# EAGLE schematic HW_RPI_10in_Rack (EAGLE 9.2.1)

## Sheet 1 of 4: CM5 MODULE
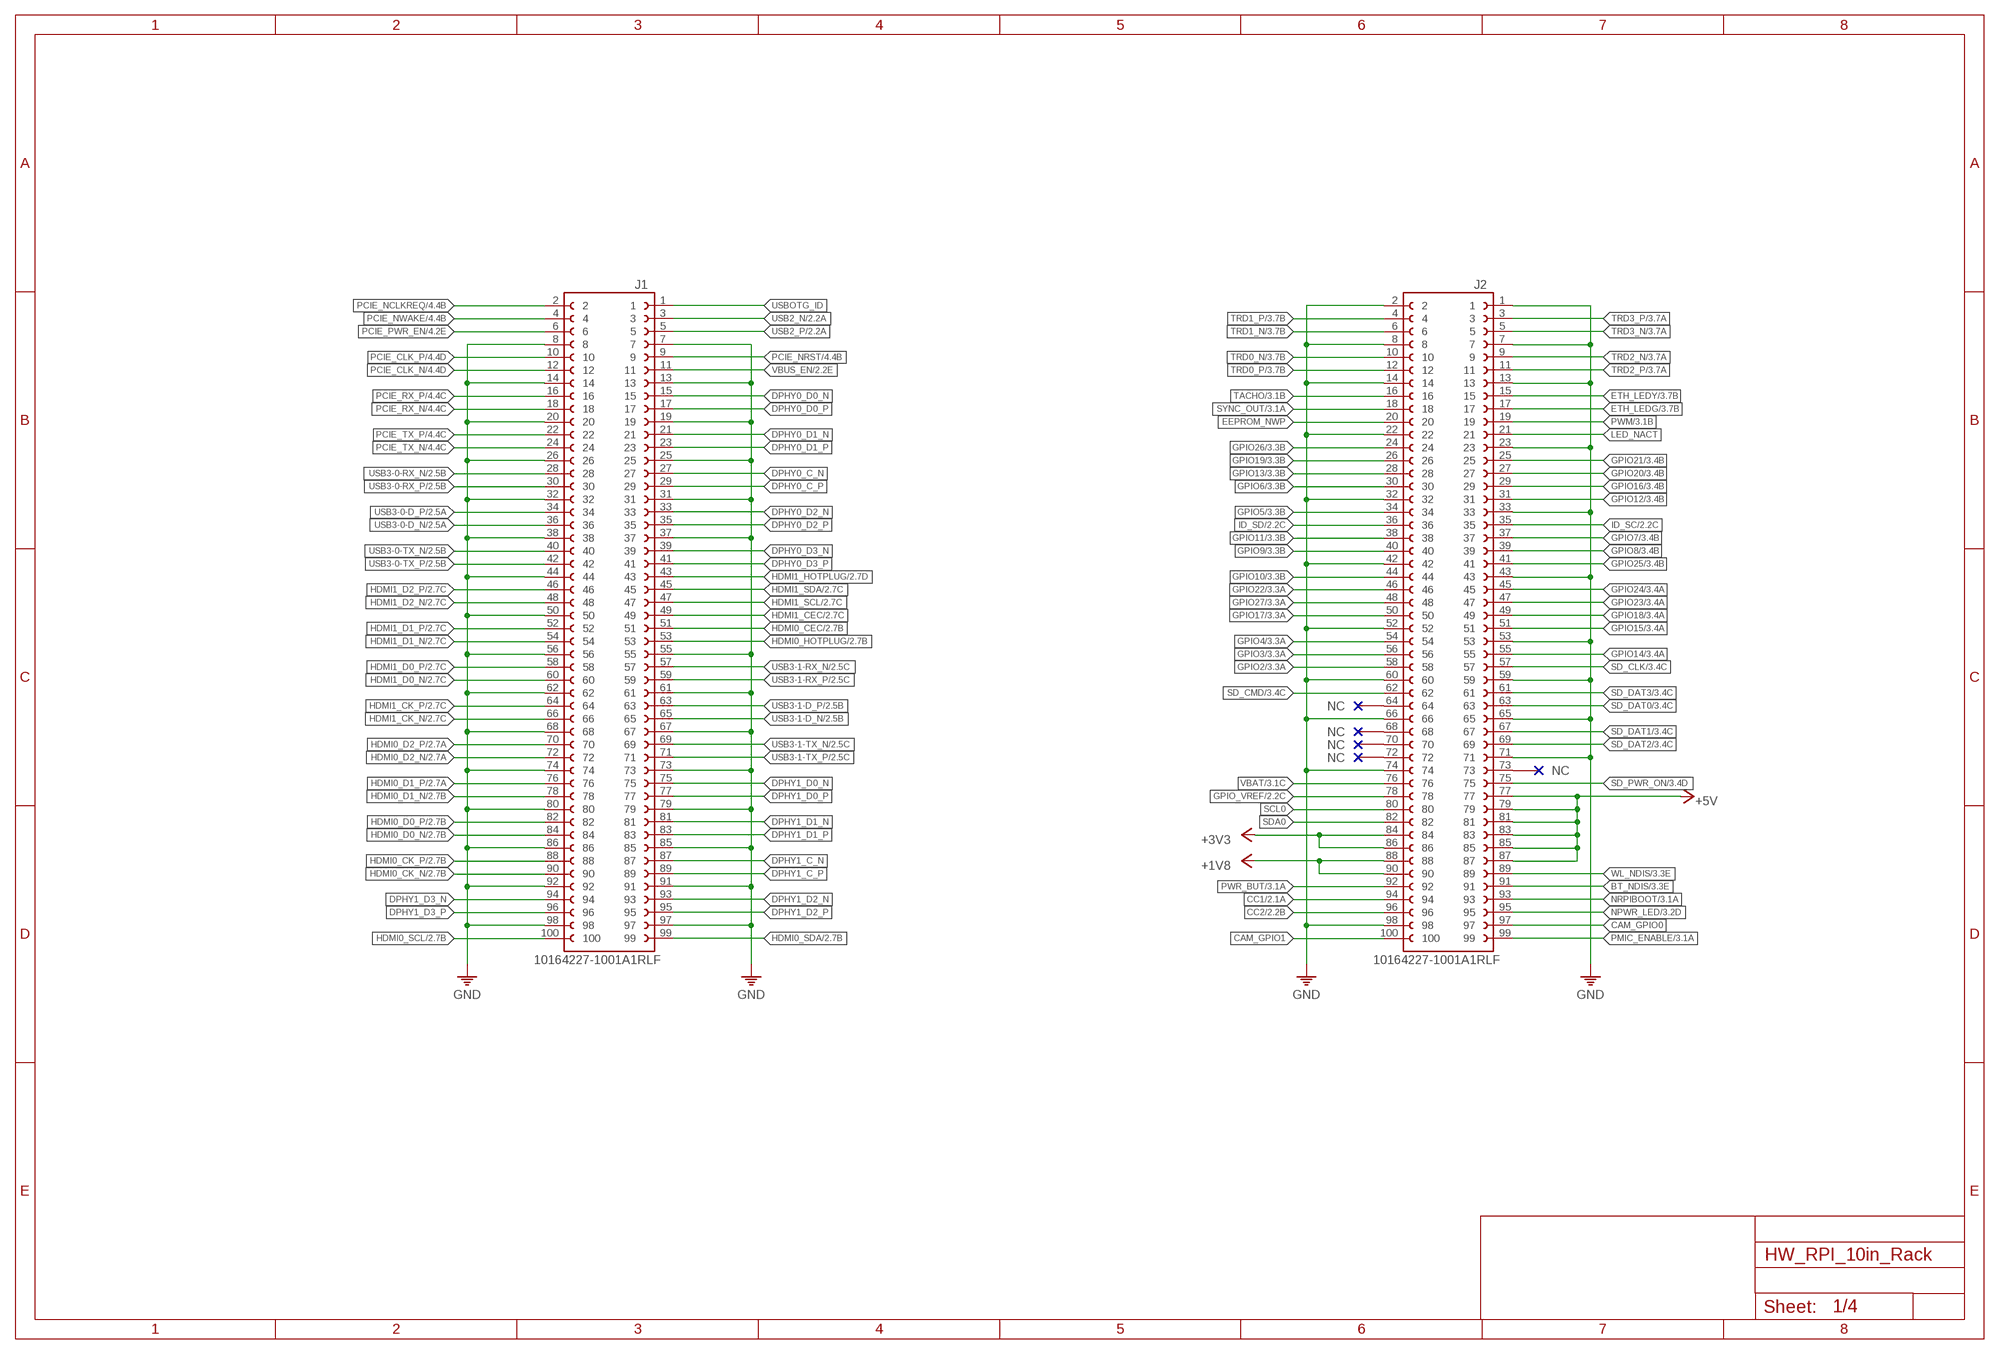
[diagram p0: schematic, sheet 1]

### Parts
J1  10164227-1001A1RLF  [AMPHENOL_10164227-1001A1RLF]
J2  10164227-1001A1RLF  [AMPHENOL_10164227-1001A1RLF]

### Nets
+1V8: J2.88 J2.90 ; also sheet 3
+3V3: J2.84 J2.86 ; also sheet 3,4
+5V: J2.77 J2.79 J2.81 J2.83 J2.85 J2.87 ; also sheet 2,3,4
BT_NDIS: J2.91 ; also sheet 3
CAM_GPIO0: J2.97
CAM_GPIO1: J2.100
CC1: J2.94 ; also sheet 2
CC2: J2.96 ; also sheet 2
DPHY0_C_N: J1.27
DPHY0_C_P: J1.29
DPHY0_D0_N: J1.15
DPHY0_D0_P: J1.17
DPHY0_D1_N: J1.21
DPHY0_D1_P: J1.23
DPHY0_D2_N: J1.33
DPHY0_D2_P: J1.35
DPHY0_D3_N: J1.39
DPHY0_D3_P: J1.41
DPHY1_C_N: J1.87
DPHY1_C_P: J1.89
DPHY1_D0_N: J1.75
DPHY1_D0_P: J1.77
DPHY1_D1_N: J1.81
DPHY1_D1_P: J1.83
DPHY1_D2_N: J1.93
DPHY1_D2_P: J1.95
DPHY1_D3_N: J1.94
DPHY1_D3_P: J1.96
EEPROM_NWP: J2.20
ETH_LEDG: J2.17 ; also sheet 3
ETH_LEDY: J2.15 ; also sheet 3
GND: J1.7 J1.8 J1.13 J1.14 J1.19 J1.20 J1.25 J1.26 J1.31 J1.32 J1.37 J1.38 J1.44 J1.50 J1.55 J1.56 J1.61 J1.62 J1.67 J1.68 J1.73 J1.74 J1.79 J1.80 J1.85 J1.86 J1.91 J1.92 J1.97 J1.98 J2.1 J2.2 J2.7 J2.8 J2.13 J2.14 J2.22 J2.23 J2.32 J2.33 J2.42 J2.43 J2.52 J2.53 J2.59 J2.60 J2.65 J2.66 J2.71 J2.74 J2.98 ; also sheet 2,3,4
GPIO2: J2.58 ; also sheet 3
GPIO3: J2.56 ; also sheet 3
GPIO4: J2.54 ; also sheet 3
GPIO5: J2.34 ; also sheet 3
GPIO6: J2.30 ; also sheet 3
GPIO7: J2.37 ; also sheet 3
GPIO8: J2.39 ; also sheet 3
GPIO9: J2.40 ; also sheet 3
GPIO10: J2.44 ; also sheet 3
GPIO11: J2.38 ; also sheet 3
GPIO12: J2.31 ; also sheet 3
GPIO13: J2.28 ; also sheet 3
GPIO14: J2.55 ; also sheet 3
GPIO15: J2.51 ; also sheet 3
GPIO16: J2.29 ; also sheet 3
GPIO17: J2.50 ; also sheet 3
GPIO18: J2.49 ; also sheet 3
GPIO19: J2.26 ; also sheet 3
GPIO20: J2.27 ; also sheet 3
GPIO21: J2.25 ; also sheet 3
GPIO22: J2.46 ; also sheet 3
GPIO23: J2.47 ; also sheet 3
GPIO24: J2.45 ; also sheet 3
GPIO25: J2.41 ; also sheet 3
GPIO26: J2.24 ; also sheet 3
GPIO27: J2.48 ; also sheet 3
GPIO_VREF: J2.78 ; also sheet 2,3
HDMI0_CEC: J1.51 ; also sheet 2
HDMI0_CK_N [100R_DIFFPAIR]: J1.90 ; also sheet 2
HDMI0_CK_P [100R_DIFFPAIR]: J1.88 ; also sheet 2
HDMI0_D0_N [100R_DIFFPAIR]: J1.84 ; also sheet 2
HDMI0_D0_P [100R_DIFFPAIR]: J1.82 ; also sheet 2
HDMI0_D1_N [100R_DIFFPAIR]: J1.78 ; also sheet 2
HDMI0_D1_P [100R_DIFFPAIR]: J1.76 ; also sheet 2
HDMI0_D2_N [100R_DIFFPAIR]: J1.72 ; also sheet 2
HDMI0_D2_P [100R_DIFFPAIR]: J1.70 ; also sheet 2
HDMI0_HOTPLUG: J1.53 ; also sheet 2
HDMI0_SCL: J1.100 ; also sheet 2
HDMI0_SDA: J1.99 ; also sheet 2
HDMI1_CEC: J1.49 ; also sheet 2
HDMI1_CK_N [100R_DIFFPAIR]: J1.66 ; also sheet 2
HDMI1_CK_P [100R_DIFFPAIR]: J1.64 ; also sheet 2
HDMI1_D0_N [100R_DIFFPAIR]: J1.60 ; also sheet 2
HDMI1_D0_P [100R_DIFFPAIR]: J1.58 ; also sheet 2
HDMI1_D1_N [100R_DIFFPAIR]: J1.54 ; also sheet 2
HDMI1_D1_P [100R_DIFFPAIR]: J1.52 ; also sheet 2
HDMI1_D2_N [100R_DIFFPAIR]: J1.48 ; also sheet 2
HDMI1_D2_P [100R_DIFFPAIR]: J1.46 ; also sheet 2
HDMI1_HOTPLUG: J1.43 ; also sheet 2
HDMI1_SCL: J1.47 ; also sheet 2
HDMI1_SDA: J1.45 ; also sheet 2
ID_SC: J2.35 ; also sheet 2,3
ID_SD: J2.36 ; also sheet 2,3
LED_NACT: J2.21
NPWR_LED: J2.95 ; also sheet 3
NRPIBOOT: J2.93 ; also sheet 3
PCIE_CLK_N: J1.12 ; also sheet 4
PCIE_CLK_P: J1.10 ; also sheet 4
PCIE_NCLKREQ: J1.2 ; also sheet 4
PCIE_NRST: J1.9 ; also sheet 4
PCIE_NWAKE: J1.4 ; also sheet 4
PCIE_PWR_EN: J1.6 ; also sheet 4
PCIE_RX_N: J1.18 ; also sheet 4
PCIE_RX_P: J1.16 ; also sheet 4
PCIE_TX_N: J1.24 ; also sheet 4
PCIE_TX_P: J1.22 ; also sheet 4
PMIC_ENABLE: J2.99 ; also sheet 3
PWM: J2.19 ; also sheet 3
PWR_BUT: J2.92 ; also sheet 3
SCL0: J2.80
SD_CLK: J2.57 ; also sheet 3
SD_CMD: J2.62 ; also sheet 3
SD_DAT0: J2.63 ; also sheet 3
SD_DAT1: J2.67 ; also sheet 3
SD_DAT2: J2.69 ; also sheet 3
SD_DAT3: J2.61 ; also sheet 3
SD_PWR_ON: J2.75 ; also sheet 3
SDA0: J2.82
SYNC_OUT: J2.18 ; also sheet 3
TACHO: J2.16 ; also sheet 3
TRD0_N [100R_DIFFPAIR]: J2.10 ; also sheet 3
TRD0_P [100R_DIFFPAIR]: J2.12 ; also sheet 3
TRD1_N [100R_DIFFPAIR]: J2.6 ; also sheet 3
TRD1_P [100R_DIFFPAIR]: J2.4 ; also sheet 3
TRD2_N [100R_DIFFPAIR]: J2.9 ; also sheet 3
TRD2_P [100R_DIFFPAIR]: J2.11 ; also sheet 3
TRD3_N [100R_DIFFPAIR]: J2.5 ; also sheet 3
TRD3_P [100R_DIFFPAIR]: J2.3 ; also sheet 3
USB2_N [90R_DIFFPAIR]: J1.3 ; also sheet 2
USB2_P [90R_DIFFPAIR]: J1.5 ; also sheet 2
USB3-0-D_N [90R_DIFFPAIR]: J1.36 ; also sheet 2
USB3-0-D_P [90R_DIFFPAIR]: J1.34 ; also sheet 2
USB3-0-RX_N [90R_DIFFPAIR]: J1.28 ; also sheet 2
USB3-0-RX_P [90R_DIFFPAIR]: J1.30 ; also sheet 2
USB3-0-TX_N [90R_DIFFPAIR]: J1.40 ; also sheet 2
USB3-0-TX_P [90R_DIFFPAIR]: J1.42 ; also sheet 2
USB3-1-D_N [90R_DIFFPAIR]: J1.65 ; also sheet 2
USB3-1-D_P [90R_DIFFPAIR]: J1.63 ; also sheet 2
USB3-1-RX_N [90R_DIFFPAIR]: J1.57 ; also sheet 2
USB3-1-RX_P [90R_DIFFPAIR]: J1.59 ; also sheet 2
USB3-1-TX_N [90R_DIFFPAIR]: J1.69 ; also sheet 2
USB3-1-TX_P [90R_DIFFPAIR]: J1.71 ; also sheet 2
USBOTG_ID: J1.1
VBAT: J2.76 ; also sheet 3
VBUS_EN: J1.11 ; also sheet 2
WL_NDIS: J2.89 ; also sheet 3
Unconnected: J2.64 J2.68 J2.70 J2.72 J2.73

## Sheet 2 of 4: CM5 HIGH SPEED INTERFACES
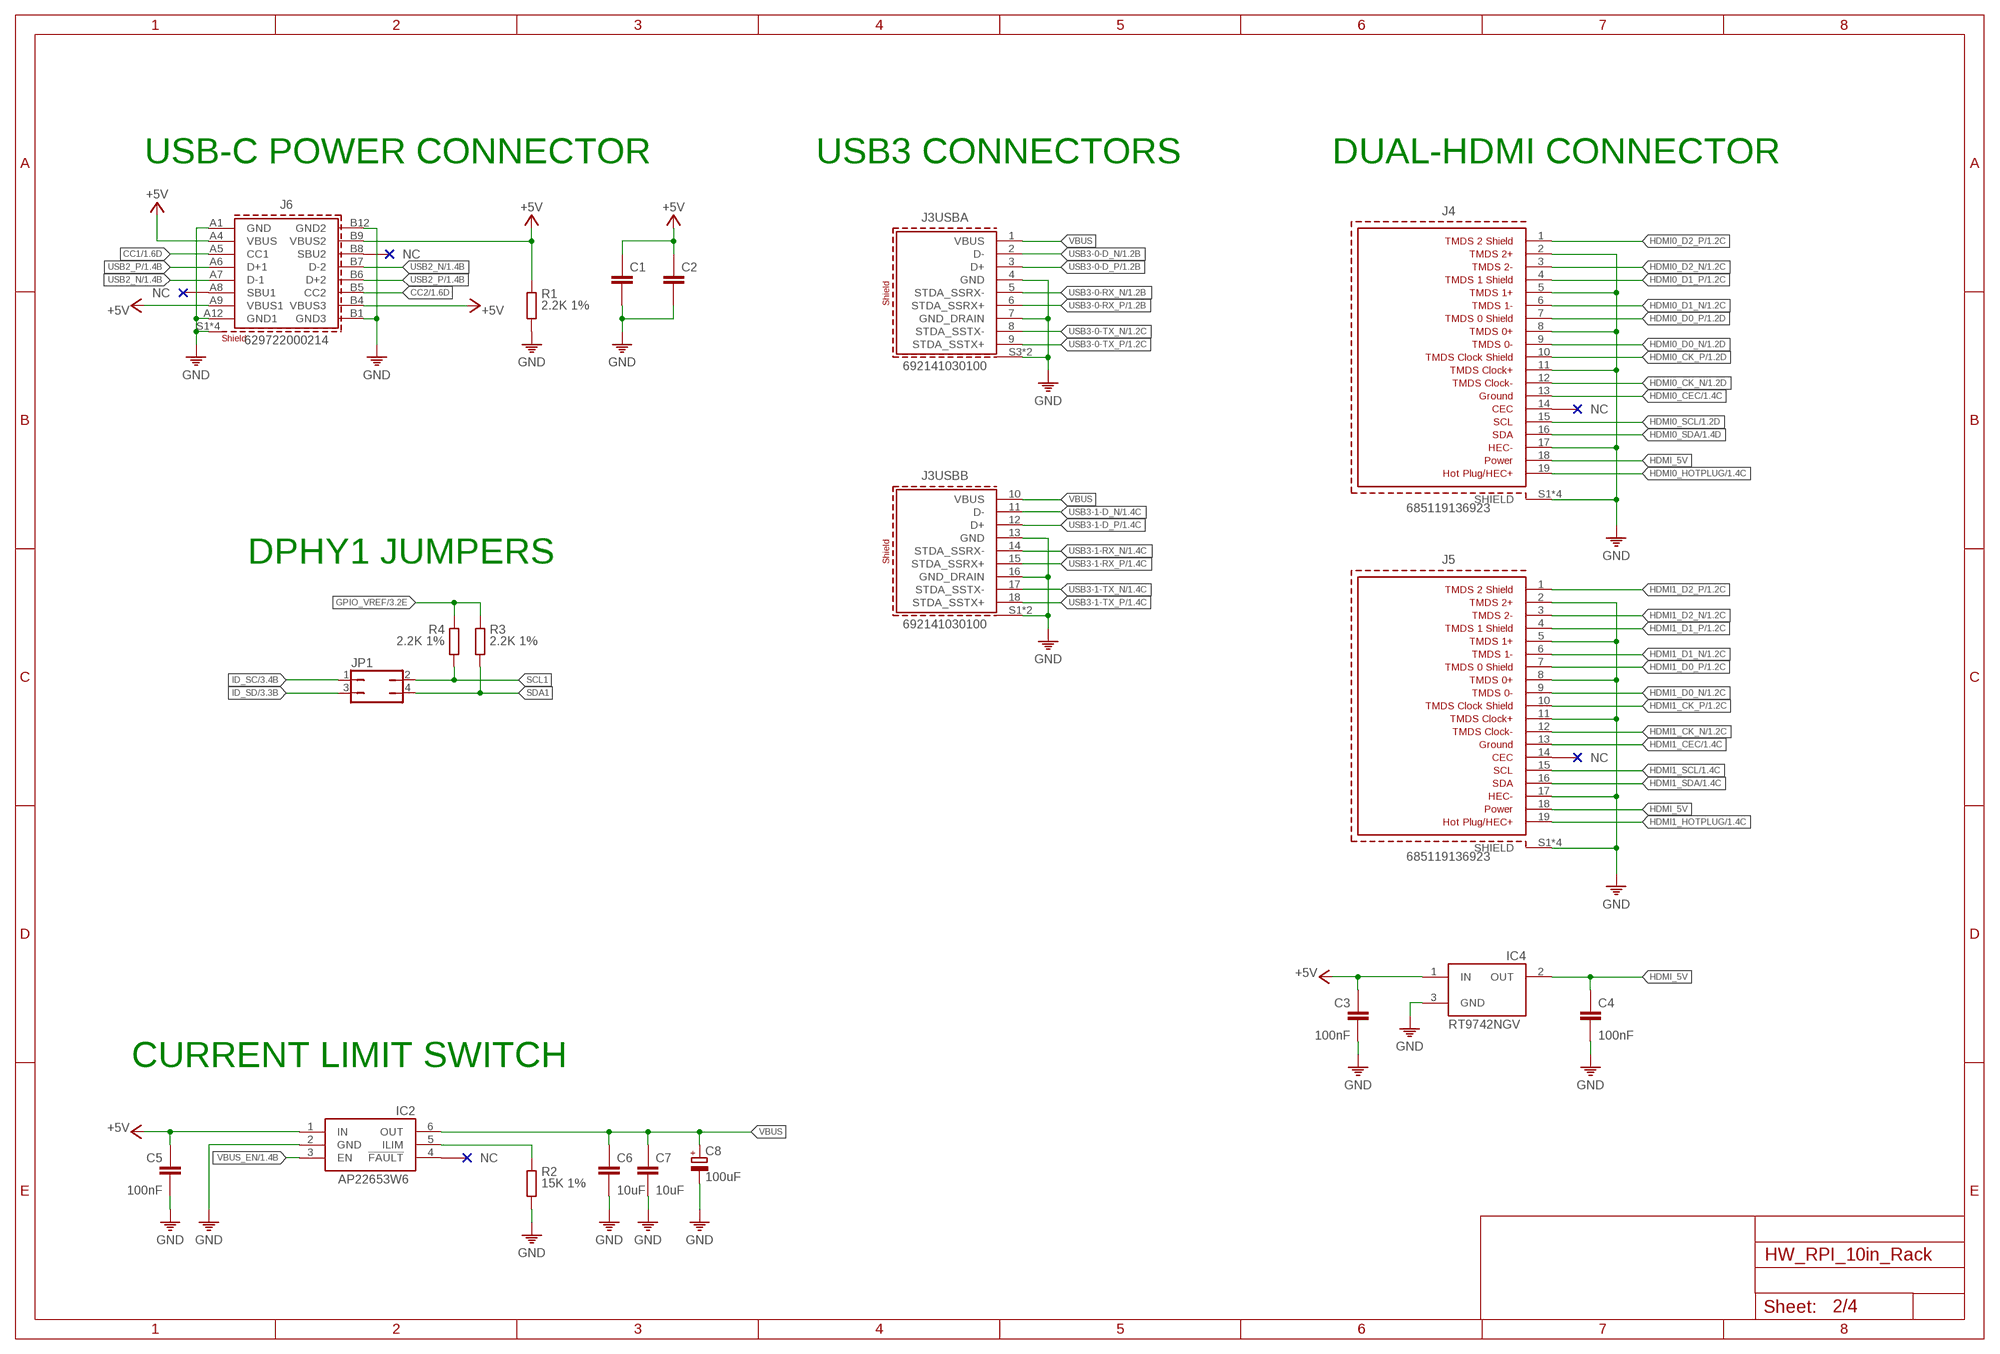
[diagram p1: schematic, sheet 2]

### Parts
C1  C0402  [0402]
C2  C0402  [0402]
C3  100nF  C0402  [0402]
C4  100nF  C0402  [0402]
C5  100nF  C0402  [0402]
C6  10uF  C0805  [0805]
C7  10uF  C0805  [0805]
C8  100uF  CPOL-EU153CLV-0505  [153CLV-0505]
IC2  AP22653W6  [SOT23-6]
IC4  RT9742NGV  [SOT23]
J3  692141030100  [692141030100]
J4  685119136923  [685119136923]
J5  685119136923  [685119136923]
J6  629722000214  [629722000214]
JP1  JP2Q  [JP2Q]
R1  2.2K 1%  R0402  [0402]
R2  15K 1%  R0402  [0402]
R3  2.2K 1%  R0402  [0402]
R4  2.2K 1%  R0402  [0402]

### Nets
+5V: C1.1 C2.1 C3.1 C5.1 IC2.1(IN) IC4.1(IN) J6.A4(VBUS) J6.A9(VBUS1) J6.B4(VBUS3) J6.B9(VBUS2) R1.1 ; also sheet 1,3,4
CC1: J6.A5(CC1) ; also sheet 1
CC2: J6.B5(CC2) ; also sheet 1
GND: C1.2 C2.2 C3.2 C4.2 C5.2 C6.2 C7.2 C8.- IC2.2(GND) IC4.3(GND) J3.4(USBA:GND) J3.7(USBA:GND_DRAIN) J3.13(USBB:GND) J3.16(USBB:GND_DRAIN) J3.S1(USBB:SHIELD) J3.S2(USBB:SHIELD) J3.S3(USBA:SHIELD) J3.S4(USBA:SHIELD) J4.2(TMDS2+) J4.5(TMDSDATA1+) J4.8(TMDS0+) J4.11(TMDSCLOCK+) J4.17(UTILITY/HEAC+) J4.S1(SHIELD) J4.S2(SHIELD) J4.S3(SHIELD) J4.S4(SHIELD) J5.2(TMDS2+) J5.5(TMDSDATA1+) J5.8(TMDS0+) J5.11(TMDSCLOCK+) J5.17(UTILITY/HEAC+) J5.S1(SHIELD) J5.S2(SHIELD) J5.S3(SHIELD) J5.S4(SHIELD) J6.A1(GND) J6.A12(GND1) J6.B1(GND3) J6.B12(GND2) J6.S1(SHIELD) J6.S2(SHIELD) J6.S3(SHIELD) J6.S4(SHIELD) R1.2 R2.2 ; also sheet 1,3,4
GPIO_VREF: R3.1 R4.1 ; also sheet 1,3
HDMI0_CEC: J4.13(GROUND) ; also sheet 1
HDMI0_CK_N [100R_DIFFPAIR]: J4.12(TMDSCLOCK-) ; also sheet 1
HDMI0_CK_P [100R_DIFFPAIR]: J4.10(TMDSCLOCKSHIELD) ; also sheet 1
HDMI0_D0_N [100R_DIFFPAIR]: J4.9(TMDS0-) ; also sheet 1
HDMI0_D0_P [100R_DIFFPAIR]: J4.7(TMDS0SHIELD) ; also sheet 1
HDMI0_D1_N [100R_DIFFPAIR]: J4.6(TMDS1-) ; also sheet 1
HDMI0_D1_P [100R_DIFFPAIR]: J4.4(TMDS1SHIELD) ; also sheet 1
HDMI0_D2_N [100R_DIFFPAIR]: J4.3(TMDS2-) ; also sheet 1
HDMI0_D2_P [100R_DIFFPAIR]: J4.1(TMDS2SHIELD) ; also sheet 1
HDMI0_HOTPLUG: J4.19(HOTPLUG/HEC+) ; also sheet 1
HDMI0_SCL: J4.15(SCL) ; also sheet 1
HDMI0_SDA: J4.16(SDA) ; also sheet 1
HDMI1_CEC: J5.13(GROUND) ; also sheet 1
HDMI1_CK_N [100R_DIFFPAIR]: J5.12(TMDSCLOCK-) ; also sheet 1
HDMI1_CK_P [100R_DIFFPAIR]: J5.10(TMDSCLOCKSHIELD) ; also sheet 1
HDMI1_D0_N [100R_DIFFPAIR]: J5.9(TMDS0-) ; also sheet 1
HDMI1_D0_P [100R_DIFFPAIR]: J5.7(TMDS0SHIELD) ; also sheet 1
HDMI1_D1_N [100R_DIFFPAIR]: J5.6(TMDS1-) ; also sheet 1
HDMI1_D1_P [100R_DIFFPAIR]: J5.4(TMDS1SHIELD) ; also sheet 1
HDMI1_D2_N [100R_DIFFPAIR]: J5.3(TMDS2-) ; also sheet 1
HDMI1_D2_P [100R_DIFFPAIR]: J5.1(TMDS2SHIELD) ; also sheet 1
HDMI1_HOTPLUG: J5.19(HOTPLUG/HEC+) ; also sheet 1
HDMI1_SCL: J5.15(SCL) ; also sheet 1
HDMI1_SDA: J5.16(SDA) ; also sheet 1
HDMI_5V: C4.1 IC4.2(OUT) J4.18(POWER) J5.18(POWER)
ID_SC: JP1.1 ; also sheet 1,3
ID_SD: JP1.3 ; also sheet 1,3
N$1: IC2.5(ILIM) R2.1
SCL1: JP1.2 R4.2
SDA1: JP1.4 R3.2
USB2_N [90R_DIFFPAIR]: J6.A7(D-1) J6.B7(D-2) ; also sheet 1
USB2_P [90R_DIFFPAIR]: J6.A6(D+1) J6.B6(D+2) ; also sheet 1
USB3-0-D_N [90R_DIFFPAIR]: J3.2(USBA:D-) ; also sheet 1
USB3-0-D_P [90R_DIFFPAIR]: J3.3(USBA:D+) ; also sheet 1
USB3-0-RX_N [90R_DIFFPAIR]: J3.5(USBA:STDA_SSRX-) ; also sheet 1
USB3-0-RX_P [90R_DIFFPAIR]: J3.6(USBA:STDA_SSRX+) ; also sheet 1
USB3-0-TX_N [90R_DIFFPAIR]: J3.8(USBA:STDA_SSTX-) ; also sheet 1
USB3-0-TX_P [90R_DIFFPAIR]: J3.9(USBA:STDA_SSTX+) ; also sheet 1
USB3-1-D_N [90R_DIFFPAIR]: J3.11(USBB:D-) ; also sheet 1
USB3-1-D_P [90R_DIFFPAIR]: J3.12(USBB:D+) ; also sheet 1
USB3-1-RX_N [90R_DIFFPAIR]: J3.14(USBB:STDA_SSRX-) ; also sheet 1
USB3-1-RX_P [90R_DIFFPAIR]: J3.15(USBB:STDA_SSRX+) ; also sheet 1
USB3-1-TX_N [90R_DIFFPAIR]: J3.17(USBB:STDA_SSTX-) ; also sheet 1
USB3-1-TX_P [90R_DIFFPAIR]: J3.18(USBB:STDA_SSTX+) ; also sheet 1
VBUS: C6.1 C7.1 C8.+ IC2.6(OUT) J3.1(USBA:VBUS) J3.10(USBB:VBUS)
VBUS_EN: IC2.3(EN) ; also sheet 1
Unconnected: IC2.4(!FAULT) J4.14(CEC) J5.14(CEC) J6.A8(SBU1) J6.B8(SBU2)

### Notes on the sheet
- USB-C POWER CONNECTOR | USB3 CONNECTORS | DUAL-HDMI CONNECTOR
- DPHY1 JUMPERS
- CURRENT LIMIT SWITCH

## Sheet 3 of 4: CM5 GPIO INTERFACES, ETHERNET
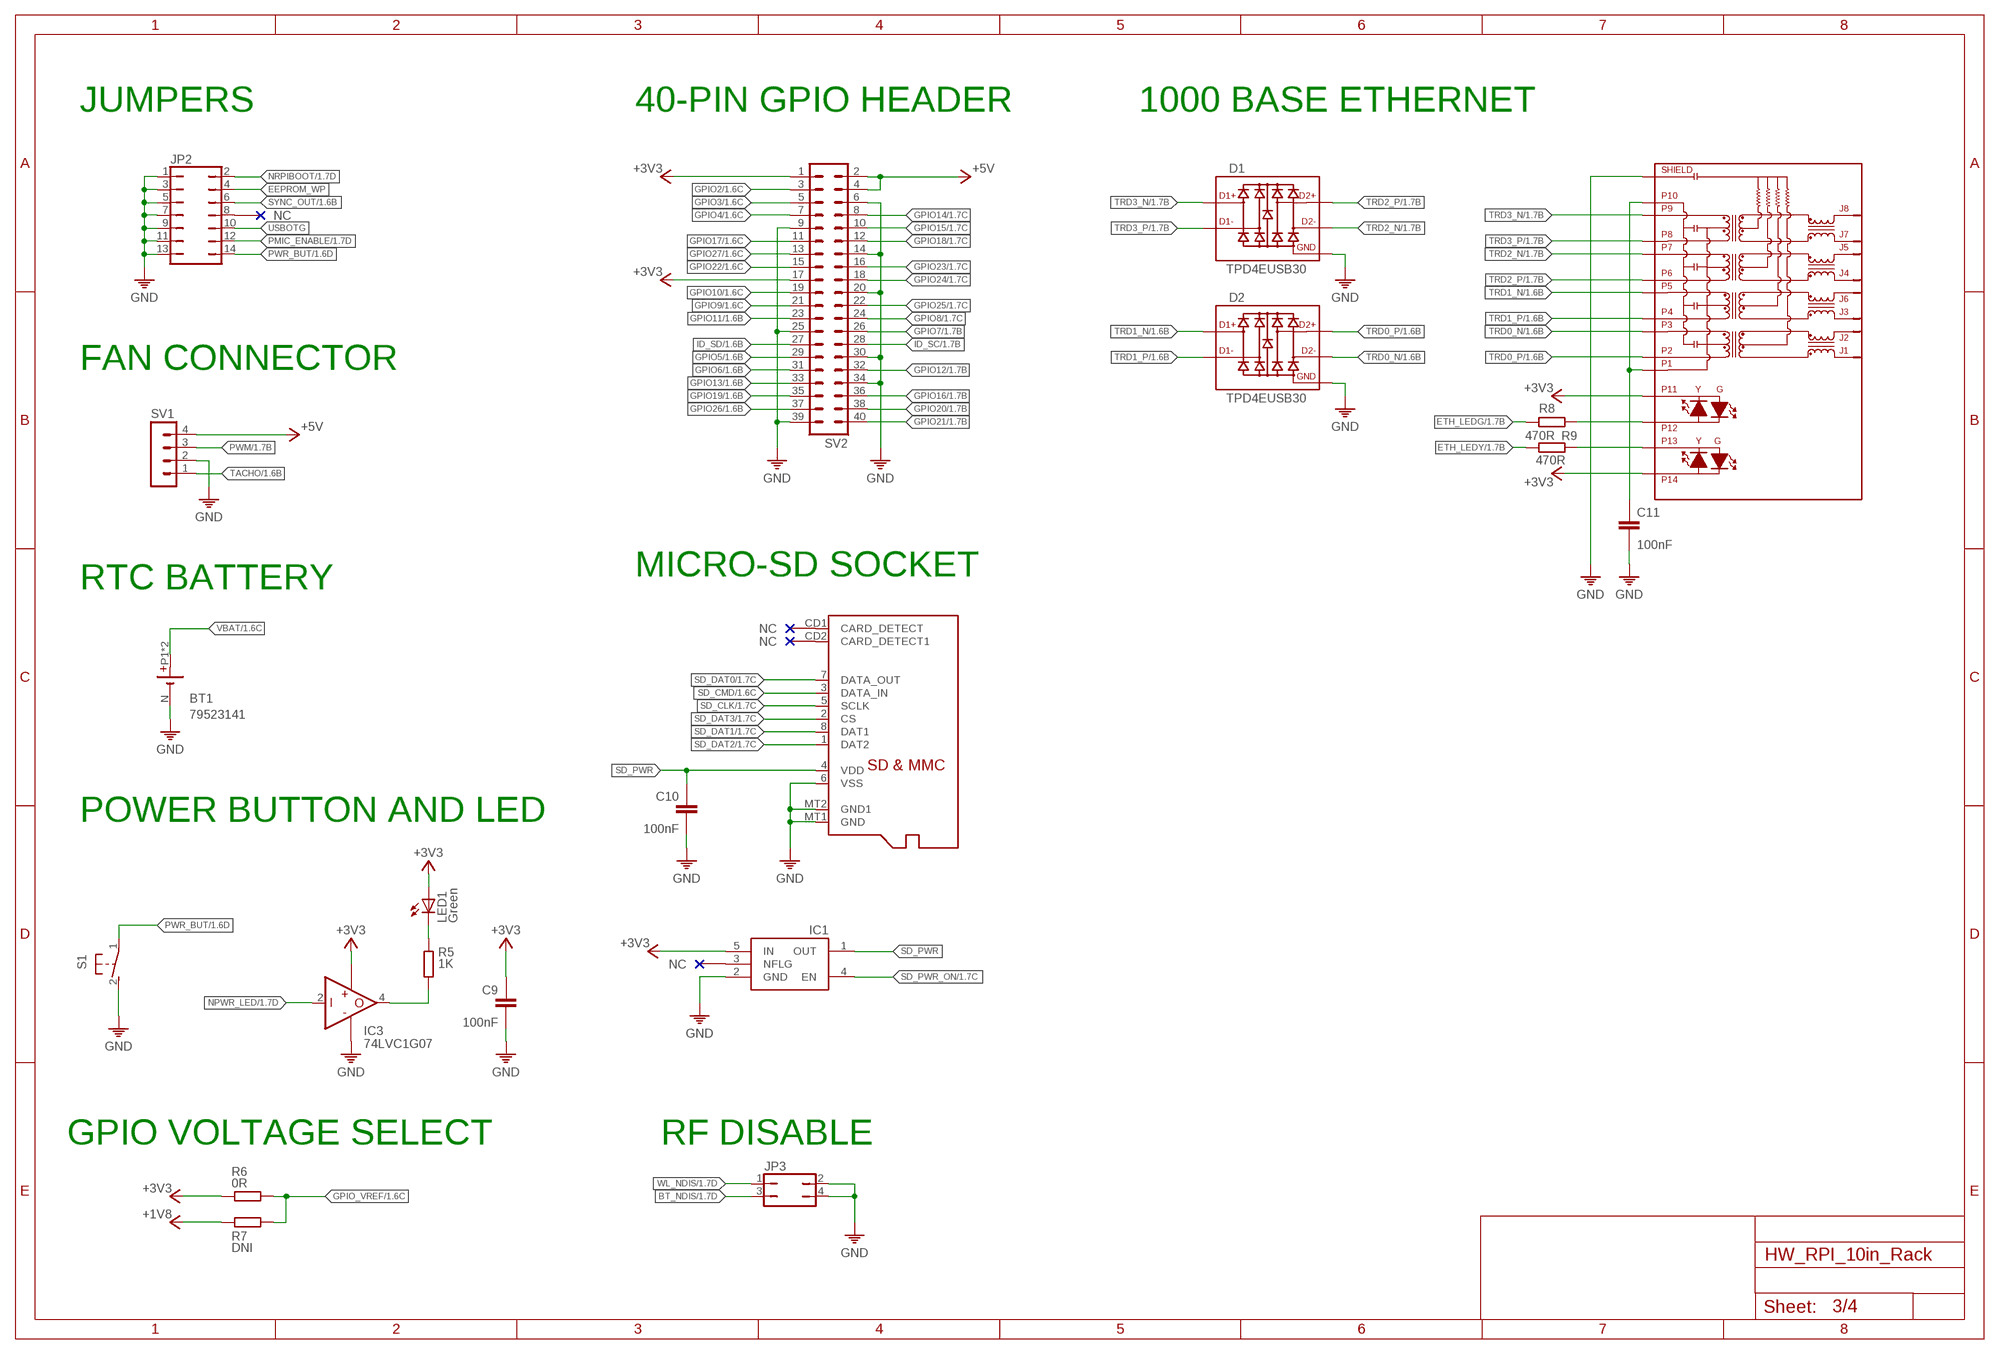
[diagram p2: schematic, sheet 3]

### Parts
BT1  79523141  [79523141]
C9  100nF  C0402  [0402]
C10  100nF  C0402  [0402]
C11  100nF  C0402  [0402]
D1  TPD4EUSB30  [USON]
D2  TPD4EUSB30  [USON]
ETH1  MAGJACK  [RJ45]
IC1  RT9742GGJ5  [SOT23-5]
IC3  74LVC1G07  [SOT23-5]
JP2  JP7Q  [JP7Q]
JP3  JP2Q  [JP2Q]
LED1  Green  LEDCHIPLED_0805  [CHIPLED_0805]
R5  1K  R0402  [0402]
R6  0R  R0402  [0402]
R7  DNI  R0402  [0402]
R8  470R  R0402  [0402]
R9  470R  R0402  [0402]
S1  31-XX  [B3F-31XX]
SV1  MA04-1  [MA04-1]
SV2  MA20-2  [MA20-2]
U$1  MICROSD  [MICROSD]

### Nets
+1V8: R7.1 ; also sheet 1
+3V3: C9.1 ETH1.P11 ETH1.P14 IC1.5(IN) IC3.5(VCC) LED1.A R6.1 SV2.1 SV2.17 ; also sheet 1,4
+5V: SV1.4 SV2.2 SV2.4 ; also sheet 1,2,4
BT_NDIS: JP3.3 ; also sheet 1
EEPROM_WP: JP2.4
ETH_LEDG: R8.1 ; also sheet 1
ETH_LEDY: R9.2 ; also sheet 1
GND: BT1.N(-) C9.2 C10.2 C11.2 D1.3(GND) D1.8(GND) D2.3(GND) D2.8(GND) ETH1.MH3(SHIELD) ETH1.MH4(SHIELD) IC1.2(GND) IC3.3(GND) JP2.1 JP2.3 JP2.5 JP2.7 JP2.9 JP2.11 JP2.13 JP3.2 JP3.4 S1.2(S) SV1.2 SV2.6 SV2.9 SV2.14 SV2.20 SV2.25 SV2.30 SV2.34 SV2.39 U$1.6(VSS) U$1.MT1(GND) U$1.MT2(GND1) ; also sheet 1,2,4
GPIO2: SV2.3 ; also sheet 1
GPIO3: SV2.5 ; also sheet 1
GPIO4: SV2.7 ; also sheet 1
GPIO5: SV2.29 ; also sheet 1
GPIO6: SV2.31 ; also sheet 1
GPIO7: SV2.26 ; also sheet 1
GPIO8: SV2.24 ; also sheet 1
GPIO9: SV2.21 ; also sheet 1
GPIO10: SV2.19 ; also sheet 1
GPIO11: SV2.23 ; also sheet 1
GPIO12: SV2.32 ; also sheet 1
GPIO13: SV2.33 ; also sheet 1
GPIO14: SV2.8 ; also sheet 1
GPIO15: SV2.10 ; also sheet 1
GPIO16: SV2.36 ; also sheet 1
GPIO17: SV2.11 ; also sheet 1
GPIO18: SV2.12 ; also sheet 1
GPIO19: SV2.35 ; also sheet 1
GPIO20: SV2.38 ; also sheet 1
GPIO21: SV2.40 ; also sheet 1
GPIO22: SV2.15 ; also sheet 1
GPIO23: SV2.16 ; also sheet 1
GPIO24: SV2.18 ; also sheet 1
GPIO25: SV2.22 ; also sheet 1
GPIO26: SV2.37 ; also sheet 1
GPIO27: SV2.13 ; also sheet 1
GPIO_VREF: R6.2 R7.2 ; also sheet 1,2
ID_SC: SV2.28 ; also sheet 1,2
ID_SD: SV2.27 ; also sheet 1,2
N$2: LED1.C R5.1
N$3: IC3.4(Y) R5.2
N$4: C11.1 ETH1.P1 ETH1.P10
N$5: ETH1.P13 R9.1
N$8: ETH1.P12 R8.2
NPWR_LED: IC3.2(A) ; also sheet 1
NRPIBOOT: JP2.2 ; also sheet 1
PMIC_ENABLE: JP2.12 ; also sheet 1
PWM: SV1.3 ; also sheet 1
PWR_BUT: JP2.14 S1.1(P) ; also sheet 1
SD_CLK: U$1.5(SCLK) ; also sheet 1
SD_CMD: U$1.3(DATA_IN) ; also sheet 1
SD_DAT0: U$1.7(DATA_OUT) ; also sheet 1
SD_DAT1: U$1.8(DAT1) ; also sheet 1
SD_DAT2: U$1.1(DAT2) ; also sheet 1
SD_DAT3: U$1.2(CS) ; also sheet 1
SD_PWR: C10.1 IC1.1(OUT) U$1.4(VDD)
SD_PWR_ON: IC1.4(EN) ; also sheet 1
SYNC_OUT: JP2.6 ; also sheet 1
TACHO: SV1.1 ; also sheet 1
TRD0_N [100R_DIFFPAIR]: D2.2(D1-) D2.9(D1-) ETH1.P3 ; also sheet 1
TRD0_P [100R_DIFFPAIR]: D2.1(D1+) D2.10(D1+) ETH1.P2 ; also sheet 1
TRD1_N [100R_DIFFPAIR]: D2.4(D2+) D2.7(D2+) ETH1.P5 ; also sheet 1
TRD1_P [100R_DIFFPAIR]: D2.5(D2-) D2.6(D2-) ETH1.P4 ; also sheet 1
TRD2_N [100R_DIFFPAIR]: D1.2(D1-) D1.9(D1-) ETH1.P7 ; also sheet 1
TRD2_P [100R_DIFFPAIR]: D1.1(D1+) D1.10(D1+) ETH1.P6 ; also sheet 1
TRD3_N [100R_DIFFPAIR]: D1.4(D2+) D1.7(D2+) ETH1.P9 ; also sheet 1
TRD3_P [100R_DIFFPAIR]: D1.5(D2-) D1.6(D2-) ETH1.P8 ; also sheet 1
USBOTG: JP2.10
VBAT: BT1.P1(+) BT1.P2(+) ; also sheet 1
WL_NDIS: JP3.1 ; also sheet 1
Unconnected: IC1.3(NFLG) JP2.8 U$1.CD1(CARD_DETECT) U$1.CD2(CARD_DETECT1)

### Notes on the sheet
- JUMPERS | 40-PIN GPIO HEADER | 1000 BASE ETHERNET
- FAN CONNECTOR
- MICRO-SD SOCKET
- RTC BATTERY
- POWER BUTTON AND LED
- GPIO VOLTAGE SELECT | RF DISABLE

## Sheet 4 of 4: CM5 PCIE-M2 INTERFACE
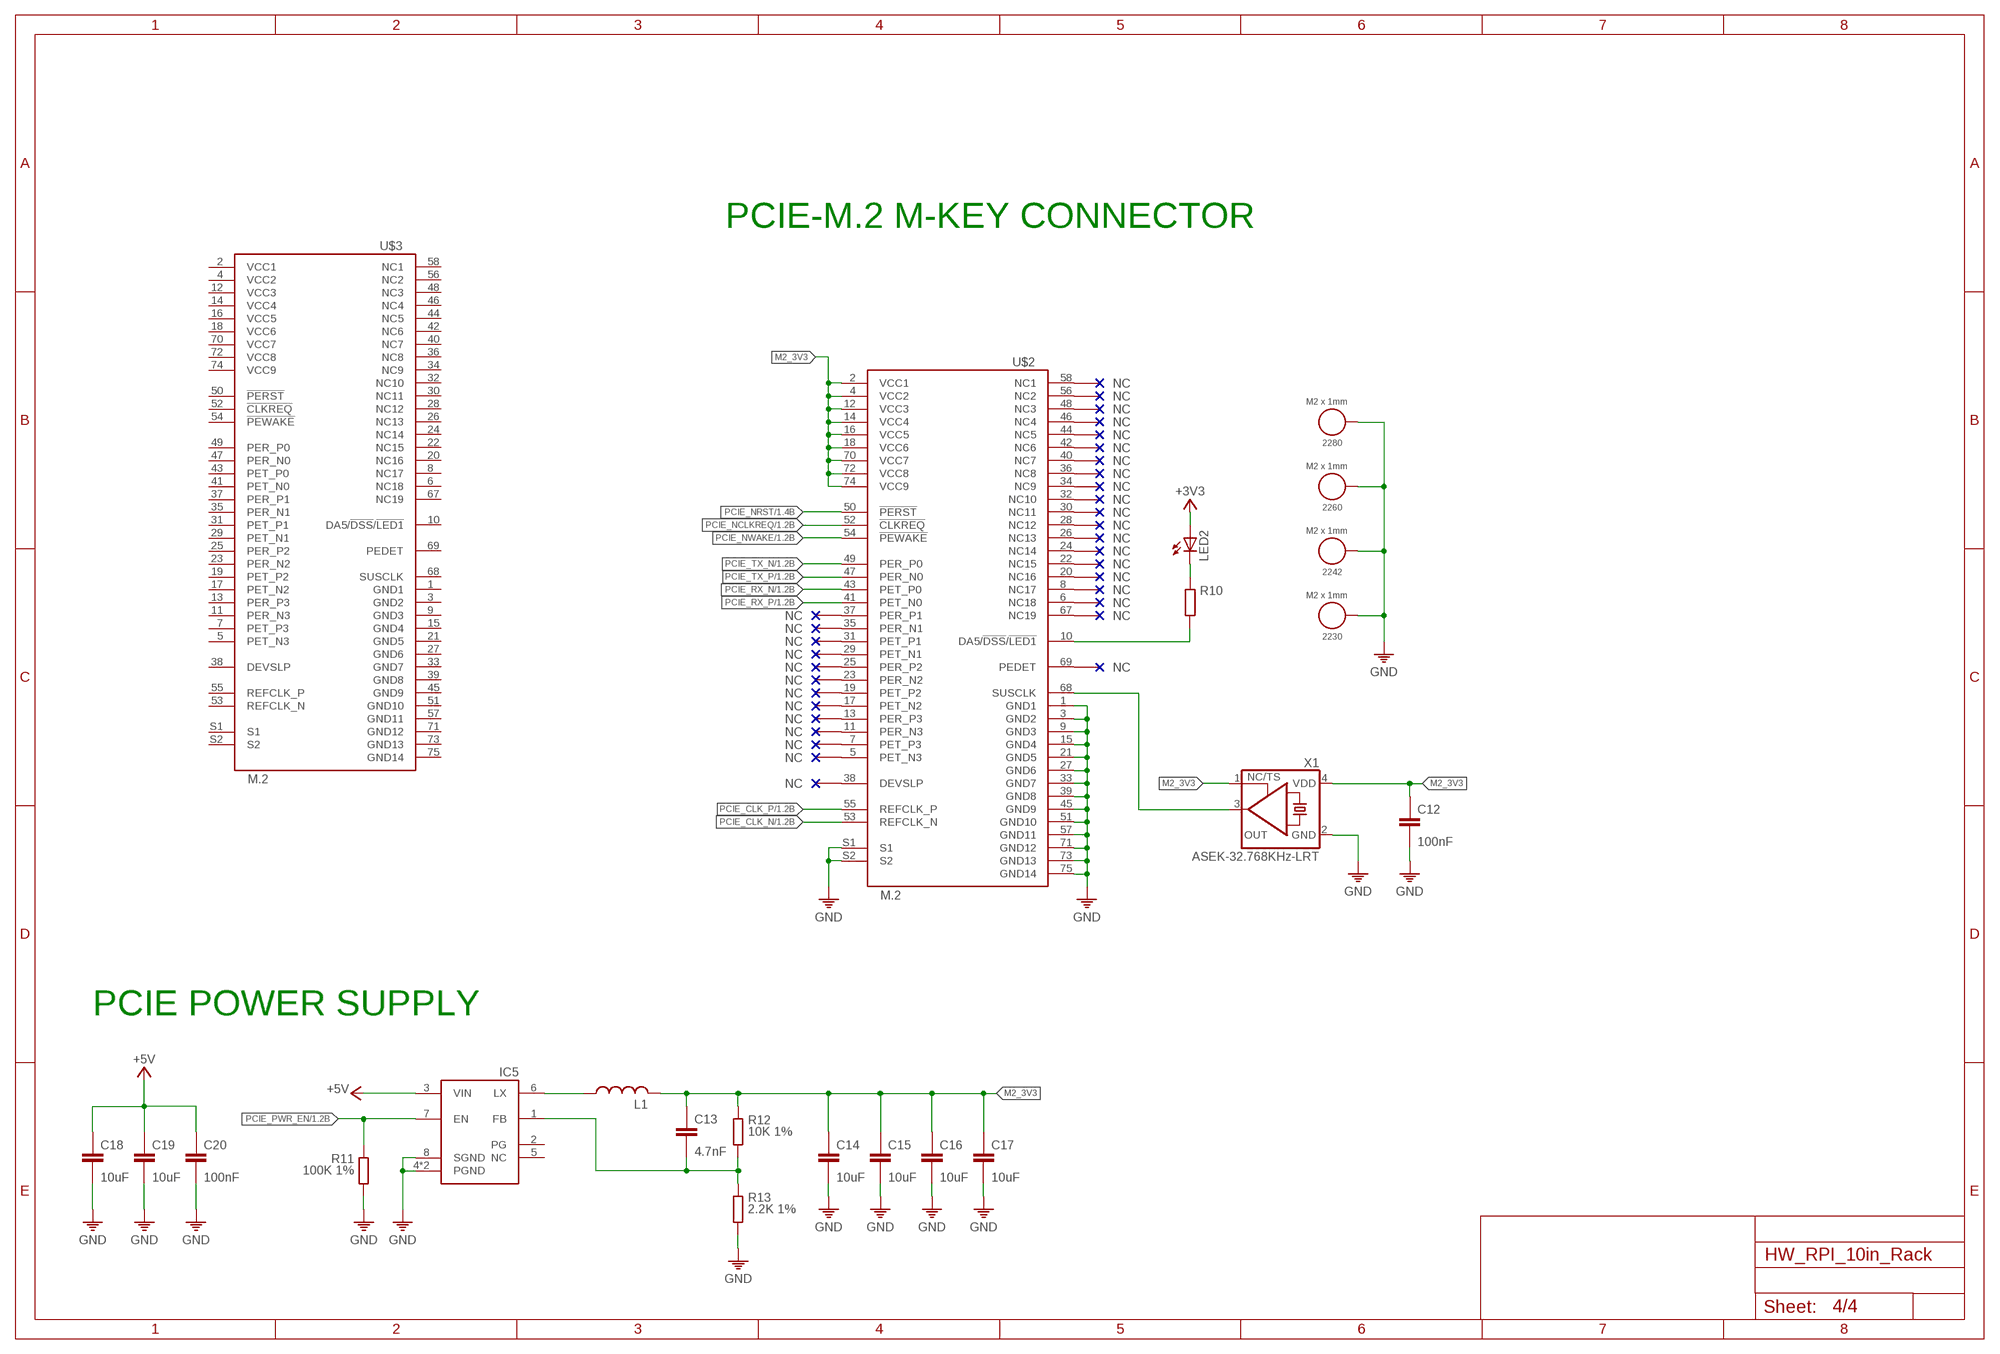
[diagram p3: schematic, sheet 4]

### Parts
2230  M2 x 1mm  WA-SMSI_9774XXX243_9774010243  [WA-SMSI_9774010243]
2242  M2 x 1mm  WA-SMSI_9774XXX243_9774010243  [WA-SMSI_9774010243]
2260  M2 x 1mm  WA-SMSI_9774XXX243_9774010243  [WA-SMSI_9774010243]
2280  M2 x 1mm  WA-SMSI_9774XXX243_9774010243  [WA-SMSI_9774010243]
C12  100nF  C0402  [0402]
C13  4.7nF  C0402  [0402]
C14  10uF  C0805  [0805]
C15  10uF  C0805  [0805]
C16  10uF  C0805  [0805]
C17  10uF  C0805  [0805]
C18  10uF  C0805  [0805]
C19  10uF  C0805  [0805]
C20  100nF  C0402  [0402]
IC5  AP3441SHE-7B  [SON50P201X201X56-9T90X170N]
L1  L-USL5038P  [L5038P]
LED2  LEDCHIPLED_0805  [CHIPLED_0805]
R10  R0402  [0402]
R11  100K 1%  R0402  [0402]
R12  10K 1%  R0402  [0402]
R13  2.2K 1%  R0402  [0402]
U$2  M.2  [M.2]
U$3  M.2  [M.2]
X1  ASEK-32.768KHz-LRT  KXO-PXO/XO-V96  [3.2X2.5_KXO-V96]

### Nets
+3V3: LED2.A ; also sheet 1,3
+5V: C18.1 C19.1 C20.1 IC5.3(VIN) ; also sheet 1,2,3
GND: 2230.1 2242.1 2260.1 2280.1 C12.2 C14.2 C15.2 C16.2 C17.2 C18.2 C19.2 C20.2 IC5.4(PGND) IC5.8(SGND) IC5.9(PGND) R11.2 R13.2 U$2.1(GND1) U$2.3(GND2) U$2.9(GND3) U$2.15(GND4) U$2.21(GND5) U$2.27(GND6) U$2.33(GND7) U$2.39(GND8) U$2.45(GND9) U$2.51(GND10) U$2.57(GND11) U$2.71(GND12) U$2.73(GND13) U$2.75(GND14) U$2.S1 U$2.S2 X1.2(GND) ; also sheet 1,2,3
M2_3V3: C12.1 C13.1 C14.1 C15.1 C16.1 C17.1 L1.2 R12.1 U$2.2(VCC1) U$2.4(VCC2) U$2.12(VCC3) U$2.14(VCC4) U$2.16(VCC5) U$2.18(VCC6) U$2.70(VCC7) U$2.72(VCC8) U$2.74(VCC9) X1.1(TS) X1.4(VDD)
N$6: R10.2 U$2.10(DA5/!DSS!/!LED1)
N$7: LED2.C R10.1
N$9: IC5.6(LX) L1.1
N$10: C13.2 IC5.1(FB) R12.2 R13.1
N$11: U$2.68(SUSCLK) X1.3(OUT)
PCIE_CLK_N: U$2.53(REFCLK_N) ; also sheet 1
PCIE_CLK_P: U$2.55(REFCLK_P) ; also sheet 1
PCIE_NCLKREQ: U$2.52(!CLKREQ) ; also sheet 1
PCIE_NRST: U$2.50(!PERST) ; also sheet 1
PCIE_NWAKE: U$2.54(!PEWAKE) ; also sheet 1
PCIE_PWR_EN: IC5.7(EN) R11.1 ; also sheet 1
PCIE_RX_N: U$2.43(PET_P0) ; also sheet 1
PCIE_RX_P: U$2.41(PET_N0) ; also sheet 1
PCIE_TX_N: U$2.49(PER_P0) ; also sheet 1
PCIE_TX_P: U$2.47(PER_N0) ; also sheet 1
Unconnected: IC5.2(PG) IC5.5(NC) U$2.5(PET_N3) U$2.6(NC18) U$2.7(PET_P3) U$2.8(NC17) U$2.11(PER_N3) U$2.13(PER_P3) U$2.17(PET_N2) U$2.19(PET_P2) U$2.20(NC16) U$2.22(NC15) U$2.23(PER_N2) U$2.24(NC14) U$2.25(PER_P2) U$2.26(NC13) U$2.28(NC12) U$2.29(PET_N1) U$2.30(NC11) U$2.31(PET_P1) U$2.32(NC10) U$2.34(NC9) U$2.35(PER_N1) U$2.36(NC8) U$2.37(PER_P1) U$2.38(DEVSLP) U$2.40(NC7) U$2.42(NC6) U$2.44(NC5) U$2.46(NC4) U$2.48(NC3) U$2.56(NC2) U$2.58(NC1) U$2.67(NC19) U$2.69(PEDET) U$3.1(GND1) U$3.2(VCC1) U$3.3(GND2) U$3.4(VCC2) U$3.5(PET_N3) U$3.6(NC18) U$3.7(PET_P3) U$3.8(NC17) U$3.9(GND3) U$3.10(DA5/!DSS!/!LED1) U$3.11(PER_N3) U$3.12(VCC3) U$3.13(PER_P3) U$3.14(VCC4) U$3.15(GND4) U$3.16(VCC5) U$3.17(PET_N2) U$3.18(VCC6) U$3.19(PET_P2) U$3.20(NC16) U$3.21(GND5) U$3.22(NC15) U$3.23(PER_N2) U$3.24(NC14) U$3.25(PER_P2) U$3.26(NC13) U$3.27(GND6) U$3.28(NC12) U$3.29(PET_N1) U$3.30(NC11) U$3.31(PET_P1) U$3.32(NC10) U$3.33(GND7) U$3.34(NC9) U$3.35(PER_N1) U$3.36(NC8) U$3.37(PER_P1) U$3.38(DEVSLP) U$3.39(GND8) U$3.40(NC7) U$3.41(PET_N0) U$3.42(NC6) U$3.43(PET_P0) U$3.44(NC5) U$3.45(GND9) U$3.46(NC4) U$3.47(PER_N0) U$3.48(NC3) U$3.49(PER_P0) U$3.50(!PERST) U$3.51(GND10) U$3.52(!CLKREQ) U$3.53(REFCLK_N) U$3.54(!PEWAKE) U$3.55(REFCLK_P) U$3.56(NC2) U$3.57(GND11) U$3.58(NC1) U$3.67(NC19) U$3.68(SUSCLK) U$3.69(PEDET) U$3.70(VCC7) U$3.71(GND12) U$3.72(VCC8) U$3.73(GND13) U$3.74(VCC9) U$3.75(GND14) U$3.S1 U$3.S2

### Notes on the sheet
- PCIE-M.2 M-KEY CONNECTOR
- PCIE POWER SUPPLY

## Library data of the parts
2230 2242 2260 2280 = Wurth_Assembly_WA-SMSI:WA-SMSI_9774XXX243: WA-SMSI SMT Steel Spacer, M2 Thread Internal Applications Assembling of PCBs to housing and to other PCBs For Distances from 1 to 8 mm Fast and precise process Strong holding forces and torques Highest process reliability Instant removable Polyimide Tape Properties Material Steel Surface Tin Ti M2 Solder Paste Thickness 150 µm Tightening Torque (Value) 0.2 N*m General Information Operating Temperature -55 up to +150 °C Details see: https://www.we-online.com/katalog/en/SMSI_SMT_STEEL_SPACER_M2_THREAD_INTERNAL Updated by Ella Wu 2020-06-03 2021(C) Wurth Elektronik; DATASHEET-URL: https://www.we-online.com/catalog/datasheet/9774010243.pdf; INNER-DIAMETER: 2.8mm; INNER-THREAD-LENGTH: -; OUTER-DIAMETER: 4.35mm; PART-NUMBER: 9774010243; PIN-LENGTH: 1mm; THREAD: M2
BT1 = Battery Holder:79523141: BATTERY RETAINER COIN 20MM SMD Manufacturer's datasheet; CREATED_BY: PCBLayout.com; DIGIKEY_PART_NO: 732-12323-2-ND; MANUFACTURER: Wurth Electronics Inc.; MPN: 79523141
C1-C7 C9-C20 = ds_passive:C
C8 = rcl:CPOL-EU: POLARIZED CAPACITOR, European symbol; SPICEPREFIX: C
D1 D2 = ds_ic_peripherals:TPD4EUSB30: TPDxEUSB30 2-, 4-Channel ESD Protection for Super-Speed USB 3.0 Interface
ETH1 = ds_con:MAGJACK
IC1 = ds_ic_peripherals:RT9742GGJ5: 70mΩ/55mΩ, 3A/2.5A/2A/1.5A/1A/0.5A High-Side Power Switches with Flag
IC2 = ds_ic_peripherals:AP22653W6: PRECISION ADJUSTABLE CURRENT-LIMITED POWER SWITCHES
IC3 = ds_ic_logic:74LVC1G07: SINGLE BUFFER/DRIVER WITH OPEN DRAIN OUTPUT
IC4 = ds_ic_peripherals:RT9742: 70mΩ/55mΩ, 3A/2.5A/2A/1.5A/1A/0.5A High-Side Power Switches with Flag
IC5 = ds_ic_vreg:AP3441SHE-7B: 1MHZ, 3A STEP-DOWN DC-DC BUCK CONVERTER
J1 J2 = ds_con:10164227-1001A1RLF; MANUFACTURER: Amphenol; MAXIMUM_PACKAGE_HEIGHT: 4.1mm; PARTREV: C; STANDARD: Manufacturer Recommendations
J3 = Wurth_Connectors_WR-USB:692141030100: WR-COM USB 3.0 Type A Stacked Kind Properties Durability:5 000 Mating cycles Quality Class:5 000 Mating cycles Connector Type:USB Gender:Receptacle Type:Stacked Horizontal General Information Operating Temperature:-40up to +85 °C Compliance:RoHS Electrical Properties IR 1:1.8A Working Voltage:30V (AC) Withstanding Voltage:100V (AC) Contact Resistance:50 mΩ Material Properties Insulator Material:LCP Insulator Flammability Rating:UL94 V-0 Color:Blue Contact Material:Phosphor Bronze Contact Plating:Matte Tin over Nickel Contact Type:Stamped Shielding Material:Brass Shielding Material:Matte Tin Details see: https://www.we-online.com/catalog/en/COM_3_0_TYPE_A_STACKED/ Updated by Yingchun, Shan 2020-01-16 2020 (C) Würth Elektronik; APPLICATION: USB 3.0; DATASHEET-URL: https://www.we-online.com/redexpert/spec/692141030100?ae; GERDER: Receptacle; INTERFACE-TYPE: Type A; IR: 1.8A; MOUNT: THT; PACKAGING: Tray; PART-NUMBER: 692141030100; PINS: 18; TYPE: Stacked Horizontal; WORKING-VOLTAGE: 30V(AC)
J4 J5 = Wurth_Connectors_WR-HDMI:685119136923: WR-COM Mini HDMI SMT Horizontal Details see: www.we-online.com/en/components/products/COM_MINI_SMT_HORIZONTAL Updated by Ella Wu 2023-05-16 2023(C) Würth Elektronik; DATASHEET-URL: https://www.we-online.com/redexpert/spec/685119136923?ae; GERDER: Receptacle; MOUNT: SMT; PART-NUMBER: 685119136923; PINS: 19; RATED-CURRENT: 0.5A; TYPE: Horizontal; WORKING-VOLTAGE: 40VAC
J6 = Wurth_Connectors_WR-USB:629722000214: WR-COM USB 2.0 Type C Receptacle Horizontal SMT Kind Properties Durability 10 000 Mating cycles Gender Receptacle Type Horizontal General Information Operating Temperature -40 up to +85 °C Electrical Properties Working Voltage 20 V (DC) Withstanding Voltage 100 V (AC) Contact Resistance 40 mΩ Material Properties Insulator Material LCP Insulator Flammability Rating UL94 V-0 Insulator Color Black Contact Material Brass Contact Plating Gold over Nickel Contact Type Stamped Shielding Material Steel Shielding Plating Nickel (Ni) Details see: www.we-online.com/en/components/products/WR-COM_USB_20_TYPE_C_RECEPTACLE_HORIZONTAL_SMT Updated by Ella Wu 2023-05-30 2023 (C) Würth Elektronik; APPLICATION: USB 2.0; DATASHEET-URL: https://www.we-online.com/redexpert/spec/629722000214?ae; GERDER: Receptacle; INTERFACE-TYPE: Type C; IR: 5A; MOUNT: SMT; PACKAGING: Tape and Reel; PART-NUMBER: 629722000214; PINS: 16; TYPE: Horizontal; WORKING-VOLTAGE: 20V(AC)
JP1 JP3 = jumper:JP2Q: JUMPER
JP2 = jumper:JP7Q: JUMPER
L1 = rcl:L-US: INDUCTOR, American symbol; SPICEPREFIX: L
LED1 LED2 = led:LED: LED OSRAM: - CHIPLED LG R971, LG N971, LY N971, LG Q971, LY Q971, LO R971, LY R971 LH N974, LH R974 LS Q976, LO Q976, LY Q976 LO Q996 - Hyper CHIPLED LW Q18S LB Q993, LB Q99A, LB R99A - SideLED LS A670, LO A670, LY A670, LG A670, LP A670 LB A673, LV A673, LT A673, LW A673 LH A674 LY A675 LS A676, LA A676, LO A676, LY A676, LW A676 LS A679, LY A679, LG A679 - Hyper Micro SIDELED® LS Y876, LA Y876, LO Y876, LY Y876 LT Y87S - SmartLED LW L88C, LW L88S LB L89C, LB L89S, LG L890 LS L89K, LO L89K, LY L89K LS L896, LA L896, LO L896, LY L896 - TOPLED LS T670, LO T670, LY T670, LG T670, LP T670 LSG T670, LSP T670, LSY T670, LOP T670, LYG T670 LG T671, LOG T671, LSG T671 LB T673, LV T673, LT T673, LW T673 LH T674 LS T676, LA T676, LO T676, LY T676, LB T676, LH T676, LSB T676, LW T676 LB T67C, LV T67C, LT T67C, LS T67K, LO T67K, LY T67K, LW E67C LS E67B, LA E67B, LO E67B, LY E67B, LB E67C, LV E67C, LT E67C LW T67C LS T679, LY T679, LG T679 LS T770, LO T770, LY T770, LG T770, LP T770 LB T773, LV T773, LT T773, LW T773 LH T774 LS E675, LA E675, LY E675, LS T675 LS T776, LA T776, LO T776, LY T776, LB T776 LHGB T686 LT T68C, LB T68C - Hyper Mini TOPLED® LB M676 - Mini TOPLED Santana® LG M470 LS M47K, LO M47K, LY M47K Source: http://www.osram.convergy.de LUXEON: - LUMILED® LXK2-PW12-R00, LXK2-PW12-S00, LXK2-PW14-U00, LXK2-PW14-V00 LXK2-PM12-R00, LXK2-PM12-S00, LXK2-PM14-U00 LXK2-PE12-Q00, LXK2-PE12-R00, LXK2-PE12-S00, LXK2-PE14-T00, LXK2-PE14-U00 LXK2-PB12-K00, LXK2-PB12-L00, LXK2-PB12-M00, LXK2-PB14-N00, LXK2-PB14-P00, LXK2-PB14-Q00 LXK2-PR12-L00, LXK2-PR12-M00, LXK2-PR14-Q00, LXK2-PR14-R00 LXK2-PD12-Q00, LXK2-PD12-R00, LXK2-PD12-S00 LXK2-PH12-R00, LXK2-PH12-S00 LXK2-PL12-P00, LXK2-PL12-Q00, LXK2-PL12-R00 Source: www.luxeon.com KINGBRIGHT: KA-3528ASYC Source: www.kingbright.com
R1-R13 = ds_passive:R
S1 = adafruit:31-XX: OMRON SWITCH Now with beefier pads!
SV1 = con-lstb:MA04-1: PIN HEADER; OC_FARNELL: unknown; OC_NEWARK: unknown
SV2 = con-lstb:MA20-2: PIN HEADER; OC_FARNELL: unknown; OC_NEWARK: unknown
U$1 = adafruit:MICROSD: Micro-SD / Transflash card holder with SPI pinout For the 3M # 2908-05WB-MG and/or 4UCON #19656 push-push type
U$2 U$3 = ds_con:M.2: Card Edge Connector, Dual Side, 67 Contacts, Surface Mount, Right Angle, Solder
X1 = crystal-geyer_V1_0:KXO-PXO/XO-V: Clock Oscillator (PXO/XO) MHz : KXO-V - Serie Model Size l/w/h [mm] Frequency Range Frequency Stability Temp. Range [°C] Output AECQ 200 availabel Datasheet KXO-V94 KXO-V94 KXO-V95 KXO-V95 KXO-V96 KXO-V96 KXO-V99 KXO-V99 KXO-97 KXO-V97 KXO-97 - KXO-V97 2.0/1.6/0.80 2.0/1.6/0.80 2.5/2.0/0.82 2.5/2.0/0.82 3.2/2.5/1.2 3.2/2.5/1.2 5.0/3.2/1.2 5.0/3.2/1.2 7.0/5.08/1.3 7.0/5.08/1.3 7.0/5.08/1.3 32,768 kHz 1,0 ~ 80,0 MHz 32,768 kHz 1,0 ~ 70,0 MHz 32,768 kHz 1,0 ~ 156,0 MHz 32,768 kHz 1,0 ~ 200,0 MHz 32,768 kHz 32,768 kHz 1,0 ~ 160,0 MHz ±25 … ±100ppm ±25 … ±100ppm ±25 … ±100ppm ±25 … ±100ppm ±25 … ±100ppm ±25 … ±100ppm ±25 … ±100ppm ±25 … ±100ppm ±25 … ±100ppm ±25 … ±100ppm ±25 … ±100ppm (*) -40°C …+85°C (*) -40°C …+85°C (*) -40°C …+85°C (*) -40°C …+85°C (*) -40°C …+85°C (*) -40°C …+85°C (*) -40°C …+85°C (*) -40°C …+85°C (*) -40°C …+85°C (*) -40°C …+85°C (*) -40°C …+85°C HCMOS HCMOS HCMOS HCMOS HCMOS HCMOS HCMOS HCMOS HCMOS HCMOS HCMOS - - yes yes yes yes - - - - - KXO-V94-kHz.pdf KXO-V94.pdf KXO-V95-kHz.pdf KXO-V95.pdf KXO-V96-kHz.pdf KXO-V96.pdf KXO-V99-kHz.pdf KXO-V99.pdf KXO-97-kHz.pdf KXO-V97-kHz.pdf KXO-V97.pdf Details see: http://www.geyer-electronic.de/Frequenz-Produkte.9.0.html Created 2016-06-07, Hans Locher 2016 (C) Geyer Quartz Technology Hans Locher KXOV94,KXOV95;KXOV96;KXOV97;KXO97;2016;2520;3225;5032;70508;2,5x2,0;3,2x2,5;5,0x3,2;7,0x5,08;2.5x2.0;3.2x2.5;5.0x3.2;7.0x5.08;

## Net classes
1 50R_DIFFPAIR: width 0.865 mm, drill 0.15 mm, clearance 0.203 mm
2 90R_DIFFPAIR: width 0.286 mm, drill 0.15 mm, clearance 0.203 mm
3 100R_DIFFPAIR: width 0.221 mm, drill 0.15 mm, clearance 0.203 mm